# Altium schematic sheet ADS1299.schdoc
size A4
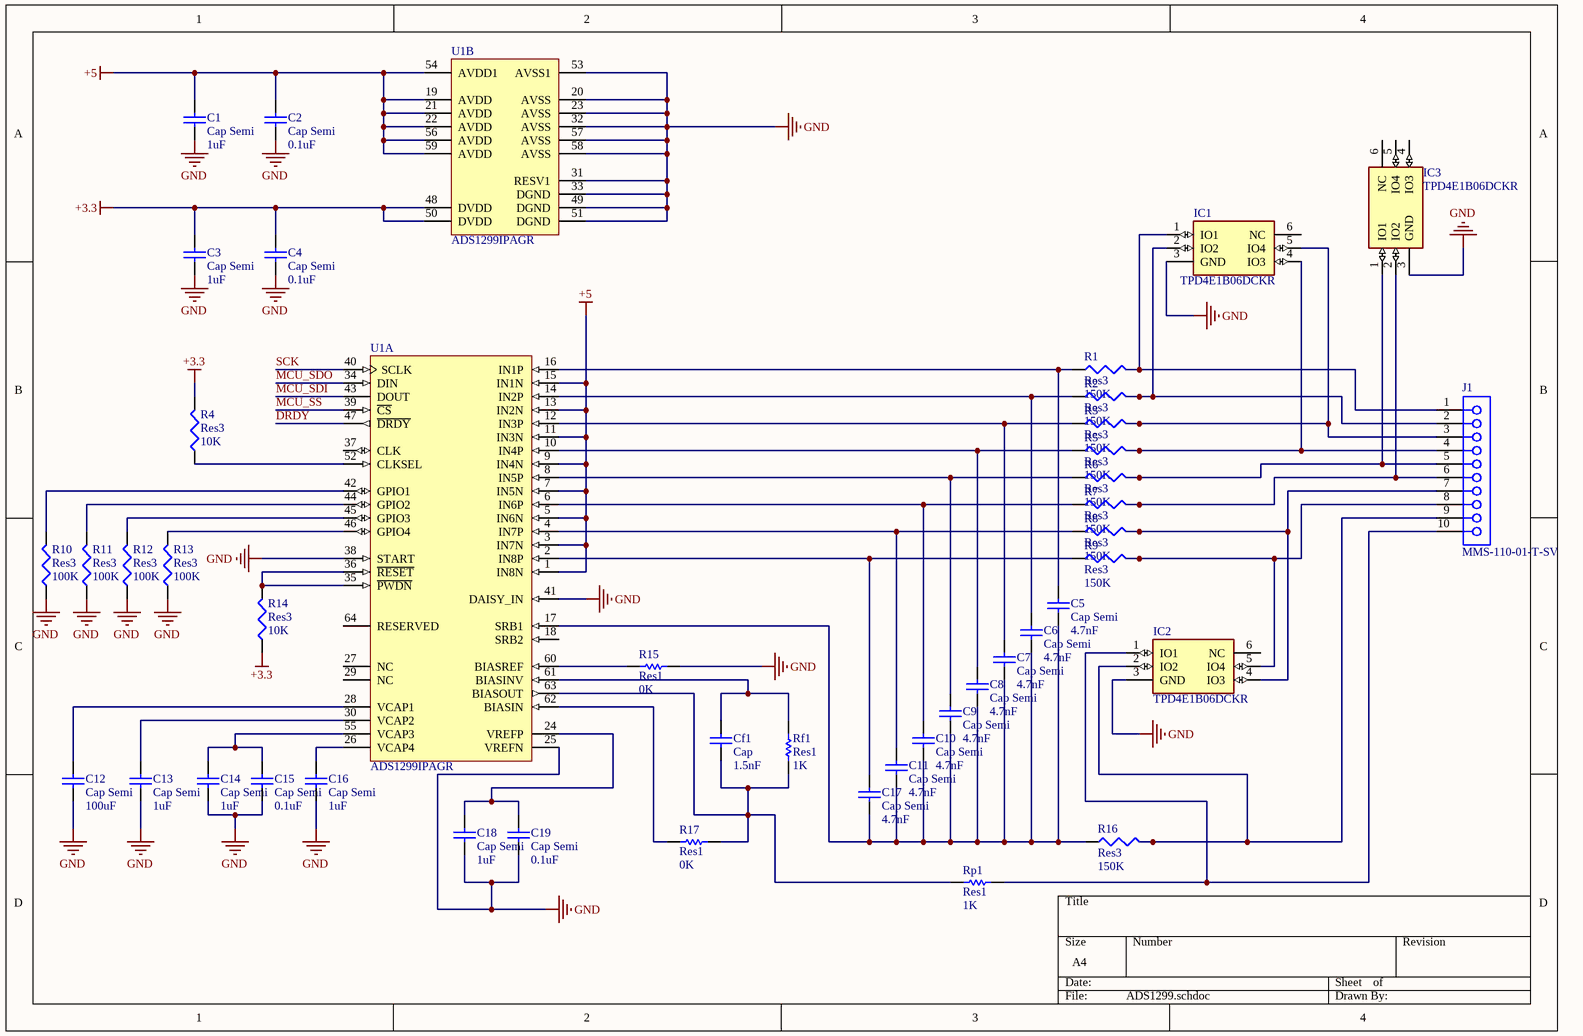
[diagram p0: ADS1299.schdoc]

## Parts
C1  Cap Semi  value 1uF  [0805c]
C2  Cap Semi  value 0.1uF  [0805c]
C3  Cap Semi  value 1uF  [0805c]
C4  Cap Semi  value 0.1uF  [0805c]
C5  Cap Semi  value 4.7nF  [0805c]
C6  Cap Semi  value 4.7nF  [0805c]
C7  Cap Semi  value 4.7nF  [0805c]
C8  Cap Semi  value 4.7nF  [0805c]
C9  Cap Semi  value 4.7nF  [0805c]
C10  Cap Semi  value 4.7nF  [0805c]
C11  Cap Semi  value 4.7nF  [0805c]
C12  Cap Semi  value 100uF  [0805c]
C13  Cap Semi  value 1uF  [0805c]
C14  Cap Semi  value 1uF  [0805c]
C15  Cap Semi  value 0.1uF  [0805c]
C16  Cap Semi  value 1uF  [0805c]
C17  Cap Semi  value 4.7nF  [0805c]
C18  Cap Semi  value 1uF  [0805c]
C19  Cap Semi  value 0.1uF  [0805c]
Cf1  Cap  value 1.5nF  [102]
IC1  TPD4E1B06DCKR  [SOT363]
IC2  TPD4E1B06DCKR  [SOT363]
IC3  TPD4E1B06DCKR  [SOT363]
J1  MMS-110-01-T-SV  [HDR1X10]
R1  Res3  value 150K  [0805]
R2  Res3  value 150K  [0805]
R3  Res3  value 150K  [0805]
R4  Res3  value 10K  [0805]
R5  Res3  value 150K  [0805]
R6  Res3  value 150K  [0805]
R7  Res3  value 150K  [0805]
R8  Res3  value 150K  [0805]
R9  Res3  value 150K  [0805]
R10  Res3  value 100K  [0805]
R11  Res3  value 100K  [0805]
R12  Res3  value 100K  [0805]
R13  Res3  value 100K  [0805]
R14  Res3  value 10K  [0805]
R15  Res1  value 0K  [RB0.4    &9]
R16  Res3  value 150K  [0805]
R17  Res1  value 0K  [RB0.4    &9]
Rf1  Res1  value 1K  [RB0.4    &9]
Rp1  Res1  value 1K  [RB0.4    &9]
U1  ADS1299IPAGR  [TQFP64_N]  (parts A,B of 2)

## Nets
+3.3: C3.2 C4.2 R4.2 R14.1 U1.48(DVDD) U1.50(DVDD)
+5: C1.2 C2.2 U1.1(IN8N) U1.3(IN7N) U1.5(IN6N) U1.7(IN5N) U1.9(IN4N) U1.11(IN3N) U1.13(IN2N) U1.15(IN1N) U1.19(AVDD) U1.21(AVDD) U1.22(AVDD) U1.54(AVDD1) U1.56(AVDD) U1.59(AVDD)
GND: C1.1 C2.1 C3.1 C4.1 C12.1 C13.1 C14.1 C15.1 C16.1 C18.1 C19.1 IC1.3(GND) IC2.3(GND) IC3.3(GND) R10.1 R11.1 R12.1 R13.1 R15.1 U1.20(AVSS) U1.23(AVSS) U1.25(VREFN) U1.31(RESV1) U1.32(AVSS) U1.33(DGND) U1.38(START) U1.41(DAISY_IN) U1.49(DGND) U1.51(DGND) U1.53(AVSS1) U1.57(AVSS) U1.58(AVSS)
DRDY: U1.47(~{DRDY})
MCU_SDI: U1.43(DOUT)
MCU_SDO: U1.34(DIN)
MCU_SS: U1.39(~{CS})
SCK: U1.40(SCLK)
NetC5_1: C5.1 C6.1 C7.1 C8.1 C9.1 C10.1 C11.1 C17.1 R16.1 U1.17(SRB1)
NetC5_2: C5.2 R1.1 U1.16(IN1P)
NetC6_2: C6.2 R2.1 U1.14(IN2P)
NetC7_2: C7.2 R3.1 U1.12(IN3P)
NetC8_2: C8.2 R5.1 U1.10(IN4P)
NetC9_2: C9.2 R6.1 U1.8(IN5P)
NetC10_2: C10.2 R7.1 U1.6(IN6P)
NetC11_2: C11.2 R8.1 U1.4(IN7P)
NetC12_2: C12.2 U1.28(VCAP1)
NetC13_2: C13.2 U1.30(VCAP2)
NetC14_2: C14.2 C15.2 U1.55(VCAP3)
NetC16_2: C16.2 U1.26(VCAP4)
NetC17_2: C17.2 R9.1 U1.2(IN8P)
NetC18_2: C18.2 C19.2 U1.24(VREFP)
NetCf1_1: Cf1.1 R17.2 Rf1.1 Rp1.1 U1.63(BIASOUT)
NetCf1_2: Cf1.2 Rf1.2 U1.61(BIASINV)
NetIC1_1: IC1.1(IO1) J1.1 R1.2
NetIC1_2: IC1.2(IO2) J1.2 R2.2
NetIC1_4: IC1.4(IO3) J1.4 R5.2
NetIC1_5: IC1.5(IO4) J1.3 R3.2
NetIC2_1: IC2.1(IO1) J1.10 Rp1.2
NetIC2_2: IC2.2(IO2) J1.9 R16.2
NetIC2_4: IC2.4(IO3) J1.7 R8.2
NetIC2_5: IC2.5(IO4) J1.8 R9.2
NetIC3_1: IC3.1(IO1) J1.5 R6.2
NetIC3_2: IC3.2(IO2) J1.6 R7.2
NetR4_1: R4.1 U1.52(CLKSEL)
NetR10_2: R10.2 U1.42(GPIO1)
NetR11_2: R11.2 U1.44(GPIO2)
NetR12_2: R12.2 U1.45(GPIO3)
NetR13_2: R13.2 U1.46(GPIO4)
NetR14_2: R14.2 U1.35(~{PWDN}) U1.36(~{RESET})
NetR15_2: R15.2 U1.60(BIASREF)
NetR17_1: R17.1 U1.62(BIASIN)

Not connected (* = marked no-connect by the designer): IC1 6(NC); IC2 6(NC); IC3 4(IO3) 5(IO4) 6(NC); U1 18(SRB2) 27(NC) 29(NC) 37(CLK) 64(RESERVED)

## Library data of the parts
C1-C19 = Cap Semi: Capacitor (Semiconductor SIM Model); Published: 8-Jun-2000; LatestRevisionDate: 29-May-2009; LatestRevisionNote: IPC-7351 Footprint Added.; PackageReference: C1206; Publisher: Altium Limited; PackageDescription: Chip Capacitor
Cf1 = Cap: Capacitor; Published: 8-Jun-2000; LatestRevisionDate: 17-Jul-2002; LatestRevisionNote: Re-released for DXP Platform.; PackageReference: RAD-0.3; Publisher: Altium Limited; PackageDescription: Radial Cap, Thru-Hole; 2 Leads; 0.3 in Pin Spacing
IC1-IC3 = TPD4E1B06DCKR: Integrated Circuit; Manufacturer_Name: Texas Instruments; Datasheet Link: http://www.ti.com/jp/lit/gpn/tpd4e1b06; Height: 1.1mm; Manufacturer_Part_Number: TPD4E1B06DCKR; Mouser Part Number: 595-TPD4E1B06DCKR; Mouser Price/Stock: https://www.mouser.com/Search/Refine.aspx?Keyword=595-TPD4E1B06DCKR; RS Part Number: 8255330P; RS Price/Stock: http://uk.rs-online.com/web/p/products/8255330P
J1 = CMP-1022-00092-1: Tiger Claw(TM) Socket Strip, Through-hole, Vertical, -55 to 105 degC, 2 mm Pitch, 10-Pin, Female, RoHS; Manufacturer: Samtec; Pitch: 2 mm; RoHS: True; Orientation: Vertical; PackageDescription: 2mm Through Hole Box Connector Strip Assembly; Mounting Technology: Through-hole; ComponentLink3Description: Package Specification; DatasheetVersion: F-214; PackageReference: MMS-110-01-X-SV; PackageVersion: AO, 2/1993; ComponentLink2Description: Datasheet; ComponentLink3URL: http://www.samtec.com/documents/webfiles/cpdf/MMS-1XX-01-XXX-XX-XXX-MKT1.pdf; Temperature Range: -55 to 105 degC; ComponentLink1URL: http://www.samtec.com; PartNumber: MMS-110-01-T-SV; ComponentLink1Description: Manufacturer URL; ComponentLink2URL: http://www.samtec.com/documents/webfiles/pdf/MMS.PDF
R1-R14 R16 = Res3: Resistor; Published: 8-Jun-2000; LatestRevisionDate: 29-May-2009; LatestRevisionNote: IPC-7351 Footprint Added.; PackageReference: J1-0603; Publisher: Altium Limited; PackageDescription: Chip Resistor
R15 R17 Rf1 Rp1 = Res1: Resistor; PackageDescription: Axial Device, Thru-Hole; 2 Leads; 0.3 in Pin Spacing; PackageReference: AXIAL-0.3; Published: 8-Jun-2000; LatestRevisionDate: 17-Jul-2002; LatestRevisionNote: Re-released for DXP Platform.; Publisher: Altium Limited
U1 = CMP-0841-00001-2: Low-Noise, 8-Channel, 24-Bit Analog Front-End for Biopotential Measurement, 16 KSPS, -40 to 85 degC, 64-Pin PQFP (PAG-64), RoHS, Tape and Reel; Manufacturer: Texas Instruments; Architecture: Delta-Sigma; Interface: Serial SPI; # Input Channels: 8; Sample Rate (max) (KSPS): 16; Packing: PAG0064A; Reference Mode: Int, Ext; Resolution (Bits): 24; PackageReference: PAG-64; ComponentLink2Description: Datasheet; Operating Temperature Range (C): -40 to 85; ComponentLink1Description: Manufacturer URL; Mounting Technology: Surface Mount; ComponentLink3Description: Package Specification; PartNumber: ADS1299IPAGR; PackageDescription: 64-Pin Plastic Quad Flatpack, Body 10 x 10 mm, Pitch 0.5 mm; ComponentLink2URL: http://www.ti.com/lit/ds/symlink/ads1299.pdf; PackageVersion: 4040282/C; ComponentLink1URL: http://www.ti.com/; ComponentLink3URL: http://www.ti.com/lit/ml/mtqf006a/mtqf006a.pdf; RoHS: TRUE; DatasheetVersion: SBAS499A